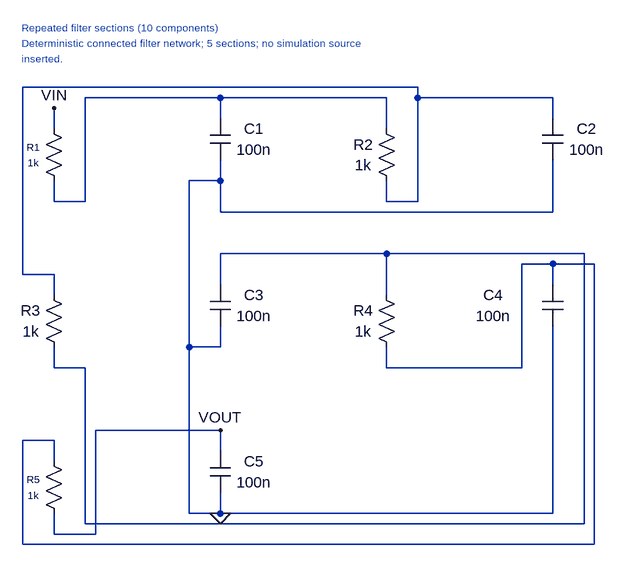
[diagram p0: schematic circuit.asc]
circuit.asc, the LTspice schematic file:
Version 4
SHEET 1 976 880
SYMBOL cap 320 128 R0
WINDOW 0 68 16 Center 2
WINDOW 3 68 48 Center 2
SYMATTR InstName C1
SYMATTR Value 100n
SYMBOL cap 832 128 R0
WINDOW 0 68 16 Center 2
WINDOW 3 68 48 Center 2
SYMATTR InstName C2
SYMATTR Value 100n
SYMBOL cap 320 384 R0
WINDOW 0 68 16 Center 2
WINDOW 3 68 48 Center 2
SYMATTR InstName C3
SYMATTR Value 100n
SYMBOL cap 832 384 R0
WINDOW 0 -76 16 Center 2
WINDOW 3 -76 48 Center 2
SYMATTR InstName C4
SYMATTR Value 100n
SYMBOL cap 320 640 R0
WINDOW 0 68 16 Center 2
WINDOW 3 68 48 Center 2
SYMATTR InstName C5
SYMATTR Value 100n
SYMBOL res 64 128 R0
WINDOW 0 -16 44 Center 1
WINDOW 3 -16 68 Center 1
SYMATTR InstName R1
SYMATTR Value 1k
SYMBOL res 576 128 R0
WINDOW 0 -20 40 Center 2
WINDOW 3 -20 72 Center 2
SYMATTR InstName R2
SYMATTR Value 1k
SYMBOL res 64 384 R0
WINDOW 0 -20 40 Center 2
WINDOW 3 -20 72 Center 2
SYMATTR InstName R3
SYMATTR Value 1k
SYMBOL res 576 384 R0
WINDOW 0 -20 40 Center 2
WINDOW 3 -20 72 Center 2
SYMATTR InstName R4
SYMATTR Value 1k
SYMBOL res 64 640 R0
WINDOW 0 -16 44 Center 1
WINDOW 3 -16 68 Center 1
SYMATTR InstName R5
SYMATTR Value 1k
WIRE 32 80 32 368
WIRE 32 80 640 80
WIRE 32 368 80 368
WIRE 32 624 32 784
WIRE 32 624 80 624
WIRE 32 784 912 784
WIRE 80 112 80 144
WIRE 80 224 80 256
WIRE 80 256 128 256
WIRE 80 368 80 400
WIRE 80 480 80 512
WIRE 80 512 128 512
WIRE 80 624 80 656
WIRE 80 736 80 768
WIRE 80 768 144 768
WIRE 128 96 128 256
WIRE 128 96 336 96
WIRE 128 512 128 752
WIRE 128 752 896 752
WIRE 144 608 144 768
WIRE 144 608 336 608
WIRE 288 224 288 480
WIRE 288 224 336 224
WIRE 288 480 288 736
WIRE 288 480 336 480
WIRE 288 736 336 736
WIRE 336 96 336 128
WIRE 336 96 592 96
WIRE 336 192 336 224
WIRE 336 224 336 272
WIRE 336 272 848 272
WIRE 336 336 336 384
WIRE 336 336 592 336
WIRE 336 448 336 480
WIRE 336 608 336 640
WIRE 336 704 336 736
WIRE 336 736 848 736
WIRE 592 96 592 144
WIRE 592 224 592 256
WIRE 592 256 640 256
WIRE 592 336 592 400
WIRE 592 336 896 336
WIRE 592 480 592 512
WIRE 592 512 800 512
WIRE 640 80 640 96
WIRE 640 96 640 256
WIRE 640 96 848 96
WIRE 800 352 800 512
WIRE 800 352 848 352
WIRE 848 96 848 128
WIRE 848 192 848 272
WIRE 848 352 848 384
WIRE 848 352 912 352
WIRE 848 448 848 736
WIRE 896 336 896 752
WIRE 912 352 912 784
FLAG 336 736 0
FLAG 80 112 VIN
FLAG 336 608 VOUT
TEXT 30 -12 Left 1 ;Repeated filter sections (10 components)
TEXT 30 12 Left 1 ;Deterministic connected filter network; 5 sections; no simulation source
TEXT 30 36 Left 1 ;inserted.

The netlist it stands for:
* circuit.asc
C1 N003 0 100n
C2 N001 0 100n
C3 N004 0 100n
C4 N002 0 100n
C5 VOUT 0 100n
R1 VIN N003 1k
R2 N003 N001 1k
R3 N001 N004 1k
R4 N004 N002 1k
R5 N002 VOUT 1k
* Repeated filter sections (10 components)
* Deterministic connected filter network; 5 sections; no simulation source
* inserted.
.backanno
.end